# EAGLE design attiny_breakout (EAGLE 6.5.0)
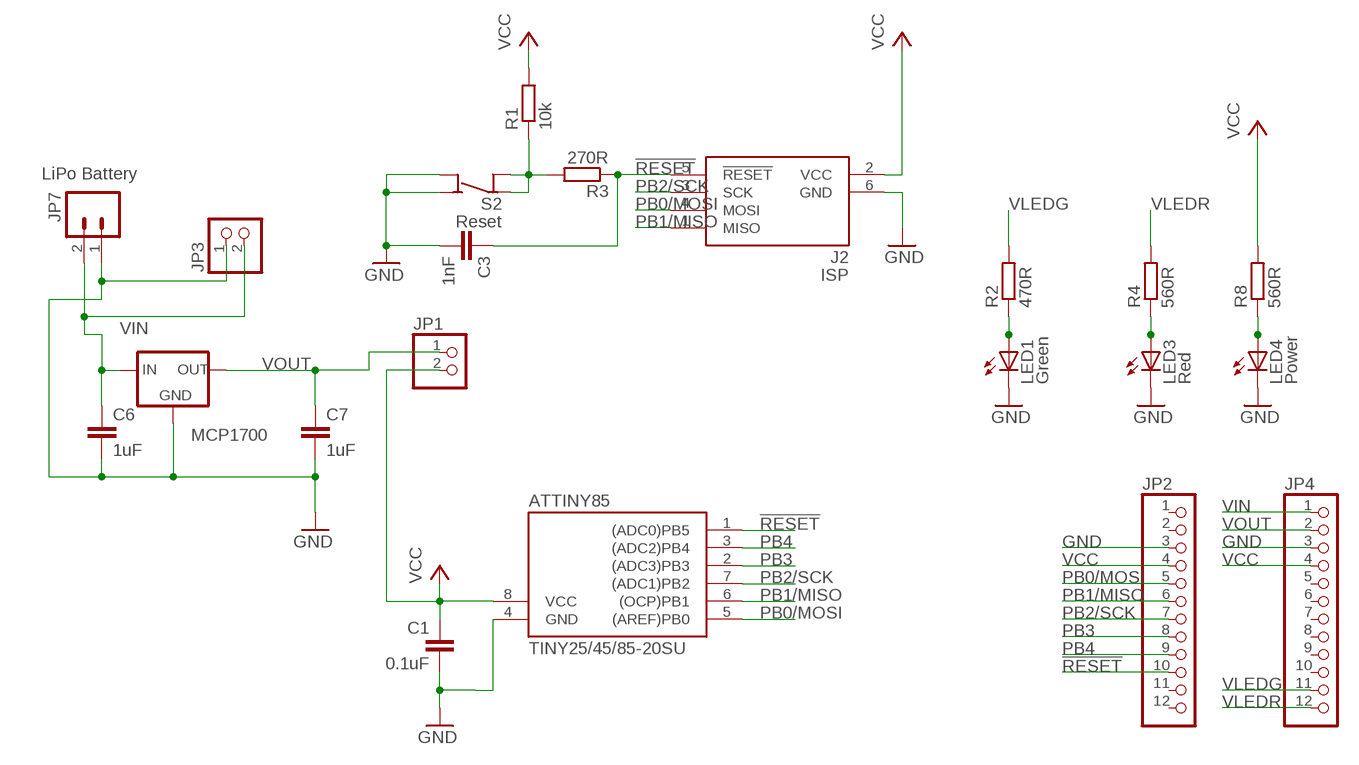
[diagram p0: schematic, sheet 1]

## Parts
ATTINY85  TINY25/45/85-20SU  [SOIC8]
C1  0.1uF  C-EUC0805  [C0805]
C3  1nF  C-EUC0805  [C0805]
C6  1uF  C-EUC0805  [C0805]
C7  1uF  C-EUC0805  [C0805]
J2  ISP  AVRISP6  [CON6P2R]
JP1  PINHD-1X2  [1X02]
JP2  PINHD-1X12  [1X12]
JP3  PINHD-1X2  [1X02]
JP4  PINHD-1X12  [1X12]
JP7  LiPo Battery  M02JST-PTH-2  [JST-2-PTH]
LED1  Green  LEDCHIP-LED0805  [CHIP-LED0805]
LED3  Red  LEDCHIP-LED0805  [CHIP-LED0805]
LED4  Power  LEDCHIP-LED0805  [CHIP-LED0805]
MCP1700  MCP1700  MCP1700SOT-23  [SOT-23]
R1  10k  R-EU_R0805  [R0805]
R2  470R  R-EU_R0805  [R0805]
R3  270R  R-EU_R0805  [R0805]
R4  560R  R-EU_R0805  [R0805]
R8  560R  R-EU_R0805  [R0805]
S2  Reset  SPST4  [6MMTACTILE_4PIN]

## Nets
!RESET: ATTINY85.1((ADC0)PB5) C3.1 J2.5(!RESET) JP2.10 R3.1
GND [GND]: ATTINY85.4(GND) C1.2 C3.2 C6.2 C7.2 J2.6(GND) JP2.3 JP3.1 JP4.3 JP7.1 LED1.C LED3.C LED4.C MCP1700.1(GND) S2.A1(NO) S2.A2(NO)
N$1: LED3.A R4.1
N$2: LED4.A R8.1
N$3: R1.1 R3.2 S2.B1(COM) S2.B2(COM)
N$4: LED1.A R2.1
PB0/MOSI: ATTINY85.5((AREF)PB0) J2.4(MOSI) JP2.5
PB1/MISO: ATTINY85.6((OCP)PB1) J2.1(MISO) JP2.6
PB2/SCK: ATTINY85.7((ADC1)PB2) J2.3(SCK) JP2.7
PB3: ATTINY85.2((ADC3)PB3) JP2.8
PB4: ATTINY85.3((ADC2)PB4) JP2.9
VCC [VCC]: ATTINY85.8(VCC) C1.1 J2.2(VCC) JP1.2 JP2.4 JP4.4 R1.2 R8.2
VIN [VCC]: C6.1 JP3.2 JP4.1 JP7.2 MCP1700.3(IN)
VLEDG: JP4.11 R2.2
VLEDR: JP4.12 R4.2
VOUT [VCC]: C7.1 JP1.1 JP4.2 MCP1700.2(OUT)
Unconnected: JP2.1 JP2.2 JP2.11 JP2.12 JP4.5 JP4.6 JP4.7 JP4.8 JP4.9 JP4.10

## Library data of the parts
ATTINY85 = avr-7:TINY25/45/85
C1 C3 C6 C7 = resistor:C-EU: CAPACITOR, European symbol
J2 = ads4:AVRISP6: 6-pin dual-row connector for Atmel AVRISP programmer interface
JP1 JP3 = pinhead:PINHD-1X2: PIN HEADER
JP2 JP4 = pinhead:PINHD-1X12: PIN HEADER
JP7 = SparkFun:M02: Header 2 Standard 2-pin 0.1" header. Use with straight break away headers (SKU : PRT-00116), right angle break away headers (PRT-00553), swiss pins (PRT-00743), machine pins (PRT-00117), and female headers (PRT-00115). Molex polarized connector foot print use with SKU : PRT-08233 with associated crimp pins and housings.
LED1 LED3 LED4 = adafruit:LED: LED OSRAM: - CHIPLED LG R971, LG N971, LY N971, LG Q971, LY Q971, LO R971, LY R971 LH N974, LH R974 LS Q976, LO Q976, LY Q976 LO Q996 - Hyper CHIPLED LW Q18S LB Q993, LB Q99A, LB R99A - SideLED LS A670, LO A670, LY A670, LG A670, LP A670 LB A673, LV A673, LT A673, LW A673 LH A674 LY A675 LS A676, LA A676, LO A676, LY A676, LW A676 LS A679, LY A679, LG A679 - Hyper Micro SIDELED® LS Y876, LA Y876, LO Y876, LY Y876 LT Y87S - SmartLED LW L88C, LW L88S LB L89C, LB L89S, LG L890 LS L89K, LO L89K, LY L89K LS L896, LA L896, LO L896, LY L896 - TOPLED LS T670, LO T670, LY T670, LG T670, LP T670 LSG T670, LSP T670, LSY T670, LOP T670, LYG T670 LG T671, LOG T671, LSG T671 LB T673, LV T673, LT T673, LW T673 LH T674 LS T676, LA T676, LO T676, LY T676, LB T676, LH T676, LSB T676, LW T676 LB T67C, LV T67C, LT T67C, LS T67K, LO T67K, LY T67K, LW E67C LS E67B, LA E67B, LO E67B, LY E67B, LB E67C, LV E67C, LT E67C LW T67C LS T679, LY T679, LG T679 LS T770, LO T770, LY T770, LG T770, LP T770 LB T773, LV T773, LT T773, LW T773 LH T774 LS E675, LA E675, LY E675, LS T675 LS T776, LA T776, LO T776, LY T776, LB T776 LHGB T686 LT T68C, LB T68C - Hyper Mini TOPLED® LB M676 - Mini TOPLED Santana® LG M470 LS M47K, LO M47K, LY M47K Source: http://www.osram.convergy.de/
MCP1700 = MY_IC:MCP1700
R1-R4 R8 = resistor:R-EU_: RESISTOR, European symbol
S2 = mes_electromech:SPST4: SPST switch with 2 pins per contact

## Net classes
0 default: width 0.305 mm, drill 0.508 mm
1 GND: width 0.457 mm, drill 0.508 mm
2 VCC: width 0.457 mm, drill 0.508 mm

## Board
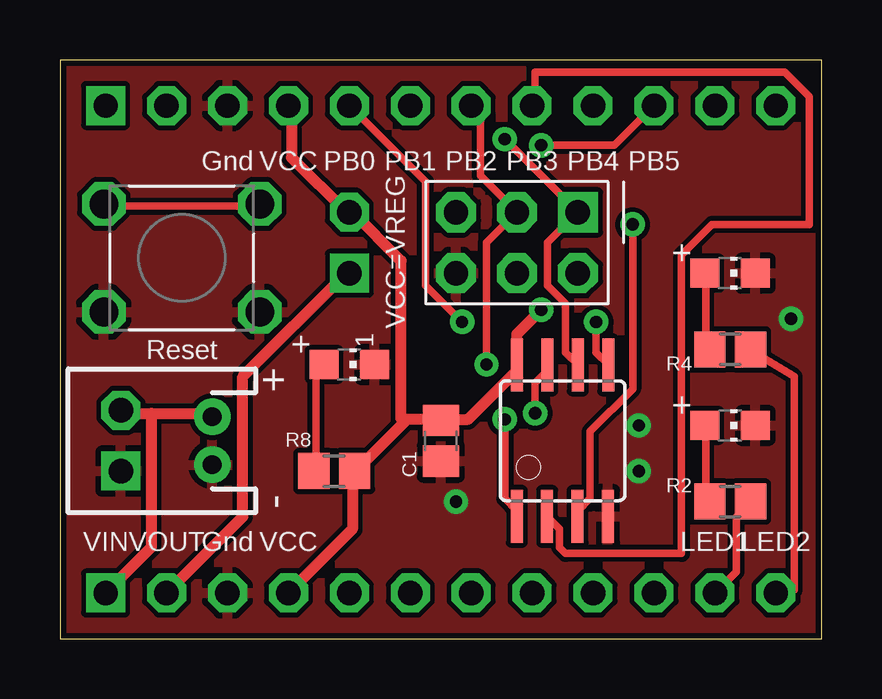
[diagram p1: board, top side]
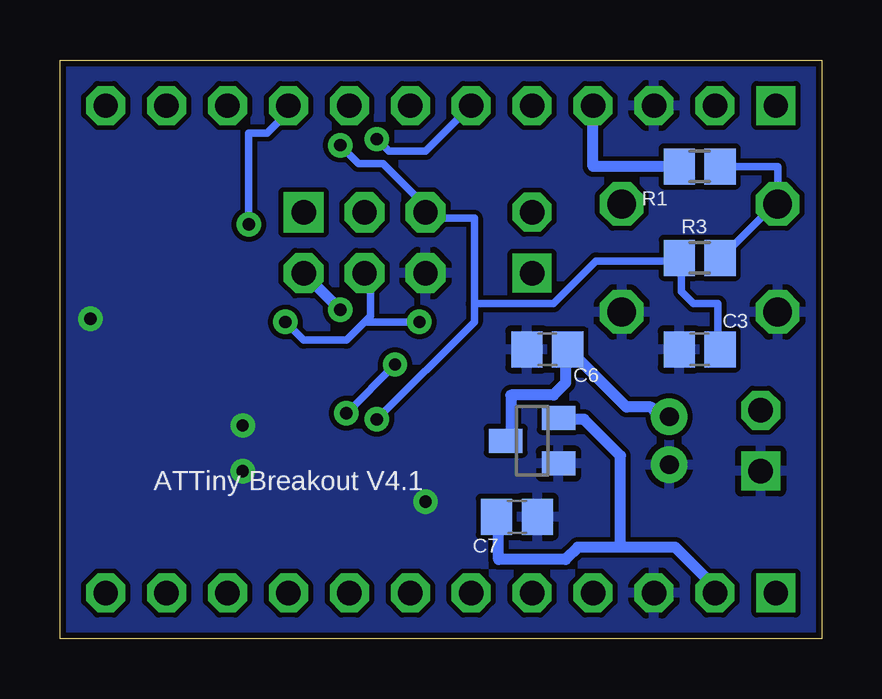
[diagram p2: board, bottom side, seen from below]

Size 31.75 x 24.13 mm. Coordinates in mm from the lower left corner, seen from the top.
Outline: 0,0 31.75,0 31.75,24.13 0,24.13 0,0
Copper layers (1*16): Top 0.035mm / dielectric 1.5mm / Bottom 0.035mm
Design rules "SparkFun *": minimum track width 10mil, minimum drill 20mil, track to track 8mil, track to pad 8mil, pad to pad 8mil, via to via 8mil, smd to smd 8mil, copper to edge 10mil, drill to drill 8mil, minimum pad ring 12mil, minimum via ring 10mil, stop-mask expansion 4mil, vias tented up to drill 25mil, thermal gap 10mil

### Footprints (pad centres in the part's own frame; a part is rotated, then mirrored left to right if it is on the bottom)
SOIC8 = smd 0.5 x 2.2: 1 -1.905,-3.154; 2 -0.645,-3.154; 3 0.625,-3.154; 4 1.895,-3.154; 5 1.905,3.154; 6 0.635,3.154; 7 -0.635,3.154; 8 -1.905,3.154
C0805 = smd 1.3 x 1.5: 1 -0.85,0; 2 0.85,0
CON6P2R = drill 1.016 pad 1.676 square: 1 -2.54,-1.27 | drill 1.016 pad 1.676 octagon: 2 -2.54,1.27; 3 0,-1.27; 4 0,1.27; 5 2.54,-1.27; 6 2.54,1.27
1X02 = drill 1.016 square: 1 -1.27,0 | drill 1.016 octagon: 2 1.27,0
1X12 = drill 1.016 square: 1 -13.97,0 | drill 1.016 octagon: 2 -11.43,0; 3 -8.89,0; 4 -6.35,0; 5 -3.81,0; 6 -1.27,0; 7 1.27,0; 8 3.81,0; 9 6.35,0; 10 8.89,0; 11 11.43,0; 12 13.97,0
JST-2-PTH = drill 0.787 pad 1.524: 1 -1,0; 2 1,0
CHIP-LED0805 = smd 1.2 x 1.2: A 0,-1.05; C 0,1.05
SOT-23 = smd 1 x 1.4: 1 -0.95,-1.1; 2 0.95,-1.1; 3 0,1.1
R0805 = smd 1.3 x 1.5: 1 -0.85,0; 2 0.85,0
6MMTACTILE_4PIN = drill 1.2 octagon: A1 3.25,-2.25; A2 -3.25,-2.25; B1 3.25,2.25; B2 -3.25,2.25

### Placement (x,y rotation side)
ATTINY85  20.95,8.25 0 top
C1  15.88,8.25 270 top
C3  5.08,12.06 180 bottom
C6  11.43,12.06 180 bottom
C7  12.7,5.08 0 bottom
J2  19.05,16.51 180 top
JP1  12.06,16.51 90 top
JP2  15.88,22.22 0 top
JP3  2.54,8.25 90 top
JP4  15.88,1.9 0 top
JP7  6.35,8.25 90 top
LED1  27.94,8.89 270 top
LED3  27.94,15.24 270 top
LED4  12.06,11.43 270 top
MCP1700  12.06,8.25 90 bottom
R1  5.08,19.68 180 bottom
R2  27.94,5.71 0 top
R3  5.08,15.87 0 bottom
R4  27.94,12.06 0 top
R8  11.43,6.98 0 top
S2  5.08,15.87 0 top

### Tracks (layer width: path | path; a pad name or v marks a point on that pad's centre or on a via)
!RESET  (via drill 0.51)
  Top 0.305: v18.54,9.14 18.54,5.84 19.05,5.33 ATTINY85.1 | JP2.10 23.11,20.57 v20.07,20.57
  Bottom 0.305: C3.1 4.32,12.19 4.32,13.97 5.33,13.97 5.84,14.48 5.84,15.75 R3.1 6.1,15.75 9.4,15.75 11.18,13.97 14.48,13.97 | v18.54,9.14 14.48,13.21 14.48,13.97 | 14.48,13.97 14.48,17.53 16,17.53 | 16,17.53 16.26,17.53 J2.5 16,17.53 | v20.07,20.57 19.3,19.81 18.29,19.81 16,17.53
GND  (via drill 0.51)
  other vias: 24.13,8.89 24.13,6.98 16.51,5.71 30.48,13.33
  pour Top: 0,24.13 31.75,24.13 31.75,0 0,0
  pour Bottom: 0,24.13 31.75,24.13 31.75,0 0,0
N$1
  Top 0.305: LED3.A 26.92,15.24 26.92,12.19 R4.1
N$2
  Top 0.305: LED4.A 10.92,11.43 10.67,11.18 10.67,7.11 R8.1
N$3
  Top 0.305: S2.B1 8.13,18.03 2.03,18.03 S2.B2
  Bottom 0.305: R3.2 4.06,16 2.03,18.03 S2.B2 1.83,19.68 R1.1
N$4
  Top 0.305: LED1.A 26.92,8.89 26.92,5.84 R2.1
PB0/MOSI  (via drill 0.51)
  Top 0.305: v22.35,13.21 22.35,11.94 22.86,11.43 ATTINY85.5 | v16.76,13.21 15.24,14.73 15.24,19.05 12.19,22.1 JP2.5
  Bottom 0.305: v22.35,13.21 21.59,12.45 19.81,12.45 19.05,13.21 | 19.05,13.21 18.8,13.46 18.8,15.24 J2.4 | 19.05,13.21 v16.76,13.21
PB1/MISO  (via drill 0.51)
  Top 0.305: ATTINY85.6 21.59,11.43 21.08,11.94 21.08,13.97 20.32,14.73 20.32,16.51 J2.1 v18.54,20.83
  Bottom 0.305: v18.54,20.83 18.03,20.32 16.51,20.32 14.73,22.1 JP2.6
PB2/SCK  (via drill 0.51)
  Top 0.305: v19.81,9.4 19.81,10.67 20.32,11.18 ATTINY85.7 | v17.78,11.43 17.78,16.51 J2.3 17.53,19.3 17.53,21.84 17.27,22.1 JP2.7
  Bottom 0.305: v17.78,11.43 v19.81,9.4
PB3
  Top 0.305: ATTINY85.2 20.32,5.08 20.83,4.57 20.83,3.81 21.08,3.56 25.91,3.56 25.91,16 27.18,17.27 31.24,17.27 31.24,22.61 30.23,23.62 19.81,23.62 19.81,22.35 JP2.8
PB4  (via drill 0.51)
  Top 0.305: v23.88,17.27 23.88,10.41 22.1,8.64 22.1,5.84 21.59,5.33 ATTINY85.3
  Bottom 0.305: v23.88,17.27 23.88,21.08 23.11,21.08 22.1,22.1 JP2.9
VCC  (via drill 0.51)
  Top 0.457: JP2.4 9.65,22.1 9.65,20.07 11.94,17.78 JP1.2 12.19,17.78 14.22,15.75 14.22,9.14 14.35,9.02 | 14.35,9.02 14.48,9.14 15.75,9.14 C1.1 16,9.14 17.02,9.14 19.05,11.18 ATTINY85.8 19.05,12.7 v20.07,13.72 | 14.35,9.02 12.45,7.11 R8.2 12.19,6.86 12.19,4.57 JP4.4
  Bottom 0.457: v20.07,13.72 J2.2 | R1.2 9.53,19.68 JP2.4
VIN
  Top 0.457: 3.81,9.4 2.54,9.4 JP3.2 | 3.81,9.4 6.35,9.4 JP7.2 | 3.81,9.4 3.81,3.81 2.03,2.03 JP4.1
  Bottom 0.457: MCP1700.3 12.95,8.38 12.95,10.16 11.18,10.16 10.67,10.67 10.67,11.94 C6.1 10.41,11.94 8.13,9.65 7.11,9.65 6.86,9.4 6.35,9.4 JP7.2
VLEDG
  Top 0.305: R2.2 28.7,5.59 28.19,5.08 28.19,2.79 27.43,2.03 JP4.11
VLEDR
  Top 0.305: R4.2 28.96,11.94 30.61,10.92 30.61,2.03 JP4.12
VOUT
  Top 0.457: JP1.1 11.94,15.24 7.62,10.92 7.62,5.08 4.57,2.03 JP4.2
  Bottom 0.457: 8.38,3.81 8.38,7.62 9.91,9.14 10.92,9.14 MCP1700.2 | 8.38,3.81 6.1,3.81 4.32,2.03 JP4.2 | 8.38,3.81 10.16,3.81 10.67,3.3 13.46,3.3 13.46,5.08 C7.1

### Text on the board
tNames: Gnd | VCC | PB0 | PB1 | PB2 | PB3 | PB4 | PB5 | VCC=VREG | 1 | + | - | VIN | VOUT | Gnd | VCC | LED1 | LED2
bNames: ATTiny Breakout V4.1